# Altium project OBC.PrjPcb (part 2 of 2)

## Sheet Microcontroller_Interfacing.SchDoc
size A4; SheetNumber: 5; SheetTotal: 7
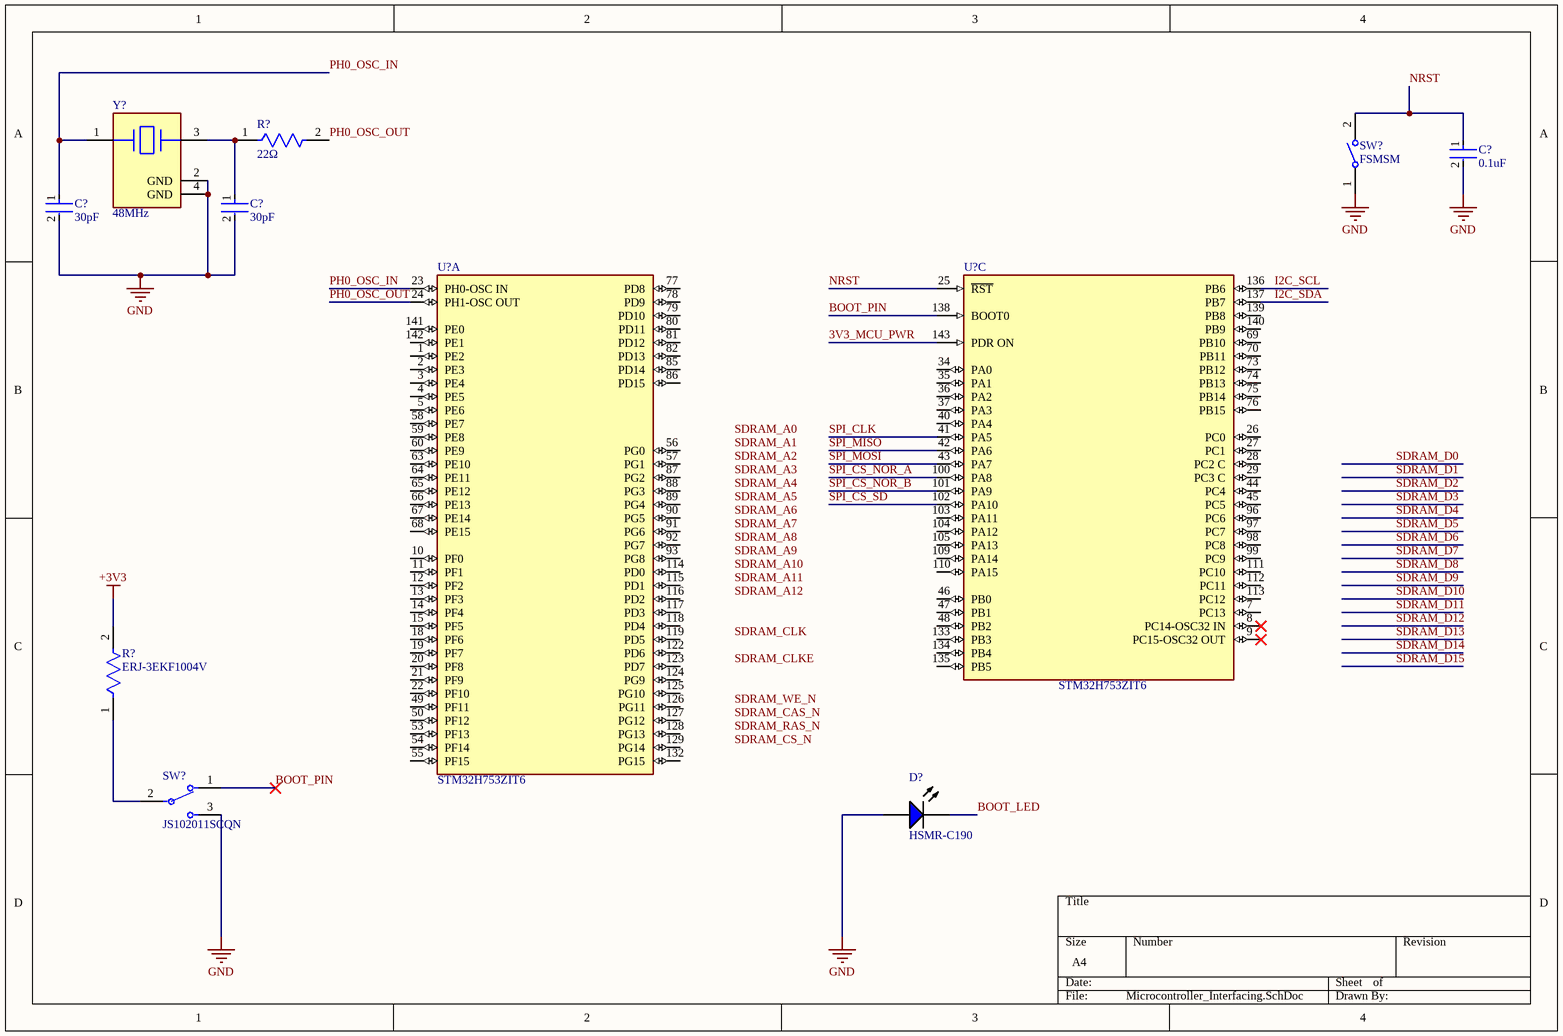
[diagram p5: Microcontroller_Interfacing.SchDoc]

### Parts
(Parts that share a designator on the sheet are numbered #1, #2 ... from top to bottom, then left to right.)
C?#29  0.1uF  [FP-GRM033-0_03-MFG]
C?#30  30pF  [FP-C0603C-CF-MFG]
C?#31  30pF  [FP-C0603C-CF-MFG]
D?#3  HSMR-C190  [AVAG-HSMX-C190_V]
R?#16  22Ω  [FP-CPF0603-MFG]
R?#17  ERJ-3EKF1004V  [FP-ERJ3EK-IPC_C]
SW?#2  FSMSM  [TECO-FSMSM-2_V]
SW?#3  JS102011SCQN  [FP-JS102011SCQN-MFG]
U?#9  STM32H753ZIT6  [FP-LQFP144-1A-MFG]  (part A of 3)
U?#10  STM32H753ZIT6  [FP-LQFP144-1A-MFG]  (part C of 3)
Y?#2  48MHz  [FP-ABM3B-MFG]

### Nets
+3V3: R?#17.2
GND: C?#29.2 C?#30.2 C?#31.2 D?#3.1(A) SW?#2.1 SW?#3.3 Y?#2.2(GND) Y?#2.4(GND)
3V3_MCU_PWR: U?#10.143(PDR_ON)
BOOT_LED: D?#3.2(K)
BOOT_PIN: SW?#3.1 U?#10.138(BOOT0)
I2C_SCL: U?#10.136(PB6)
I2C_SDA: U?#10.137(PB7)
NRST: C?#29.1 SW?#2.2 U?#10.25(~{RST})
PH0_OSC_IN: C?#30.1 U?#9.23(PH0-OSC_IN) Y?#2.1
PH0_OSC_OUT: R?#16.2 U?#9.24(PH1-OSC_OUT)
SPI_CLK: U?#10.41(PA5)
SPI_CS_NOR_A: U?#10.100(PA8)
SPI_CS_NOR_B: U?#10.101(PA9)
SPI_CS_SD: U?#10.102(PA10)
SPI_MISO: U?#10.42(PA6)
SPI_MOSI: U?#10.43(PA7)
NetC?#31_1: C?#31.1 R?#16.1 Y?#2.3
NetR?#17_1: R?#17.1 SW?#3.2(C)

Not connected (* = marked no-connect by the designer): U?#9 1(PE2) 2(PE3) 3(PE4) 4(PE5) 5(PE6) 10(PF0) 11(PF1) 12(PF2) 13(PF3) 14(PF4) 15(PF5) 18(PF6) 19(PF7) 20(PF8) 21(PF9) 22(PF10) 49(PF11) 50(PF12) 53(PF13) 54(PF14) 55(PF15) 56(PG0) 57(PG1) 58(PE7) 59(PE8) 60(PE9) 63(PE10) 64(PE11) 65(PE12) 66(PE13) 67(PE14) 68(PE15) 77(PD8) 78(PD9) 79(PD10) 80(PD11) 81(PD12) 82(PD13) 85(PD14) 86(PD15) 87(PG2) 88(PG3) 89(PG4) 90(PG5) 91(PG6) 92(PG7) 93(PG8) 114(PD0) 115(PD1) 116(PD2) 117(PD3) 118(PD4) 119(PD5) 122(PD6) 123(PD7) 124(PG9) 125(PG10) 126(PG11) 127(PG12) 128(PG13) 129(PG14) 132(PG15) 141(PE0) 142(PE1); U?#10 7(PC13) 8(PC14-OSC32_IN)* 9(PC15-OSC32_OUT)* 26(PC0) 27(PC1) 28(PC2_C) 29(PC3_C) 34(PA0) 35(PA1) 36(PA2) 37(PA3) 40(PA4) 44(PC4) 45(PC5) 46(PB0) 47(PB1) 48(PB2) 69(PB10) 70(PB11) 73(PB12) 74(PB13) 75(PB14) 76(PB15) 96(PC6) 97(PC7) 98(PC8) 99(PC9) 103(PA11) 104(PA12) 105(PA13) 109(PA14) 110(PA15) 111(PC10) 112(PC11) 113(PC12) 133(PB3) 134(PB4) 135(PB5) 139(PB8) 140(PB9)

### Notes on the sheet
- Labels drawn without touching a wire or pin: SDRAM_A0, SDRAM_A1, SDRAM_A2, SDRAM_A3, SDRAM_A4, SDRAM_A5, SDRAM_A6, SDRAM_A7, SDRAM_A8, SDRAM_A9, SDRAM_A10, SDRAM_A11, SDRAM_A12, SDRAM_CAS_N, SDRAM_CLK, SDRAM_CLKE, SDRAM_CS_N, SDRAM_RAS_N, SDRAM_WE_N

### Library data of the parts
C?#29 = CMP-06035-000062-2: Chip Multilayer Ceramic Capacitors for General Purpose, 0201, 0.10uF, X5R, 15%, 10%, 6.3V; Capacitance: 100nF; Min Operating Temperature: -55°C; Lead Free: Lead Free; Radiation Hardening: No; Dielectric: X5R; Voltage Rating (DC): 6.3V; REACH SVHC: No SVHC; Case/Package: 0201; Voltage Rating: 6.3V; Length: 0.6mm; Max Operating Temperature: 85°C; Width: 0.012inch; Depth: 0.3mm; Material: Ceramic; Case Code (Metric): 0603; Thickness: 0.013inch; Packaging: Tape and Reel; Height: 0.3mm; Weight: 6E-06oz; Package Quantity: 1; Mount: Surface Mount; Voltage: 6.3V; Case Code (Imperial): 0201; Tolerance: 10%; Termination: SMD/SMT
C?#30 C?#31 = CMP-1035-00914-3: CAP CER 30PF 50V 5% NP0 0603; Manufacturer Part Number: C0603C300J5GACTU; Manufacturer: KEMET; Automotive Grade: Grade 1; Temperature Coefficient: 30ppm/°C; Material: Ceramic; Temperature Characteristic: C0G; Tolerance: 0.05; Description: C0603 30 pF C0G 30ppm/°C 5.00% 50 V; ComponentLink2URL: https://api.kemet.com/component-edge/download/datasheet/C0603C100J5GACAUTO.pdf; Automotive: Yes; Device Class L2: Capacitors; Device Class L1: Passive Components; Device Class L3: Ceramic Capacitors; RoHS: TRUE; Octopart: https://octopart.com/c0603c300j5gactu-kemet-199455; Lead Free: Yes; Value: 30 pF; Temperature Range High: +125°C; Category: Cap; Temperature: -55°C to +125°C; Package: C0603C-CF; Capacitance: 30 pF; Digikey Description: CAP CER 30PF 50V 5% NP0 0603; Height: 0.87mm; ComponentLink2Description: Datasheet; Temperature Range Low: -55°C; Mouser Description: Multilayer Ceramic Capacitors MLCC - SMD/SMT 50volts 30pF C0G 5%; Voltage Rating: 50 V
D?#3 = CMP-1744-00007-1: LED Uni-Color Blue, 78 mW, 20 mA, -40 to 85 degC, 2-Pin SMD, RoHS, Tape and Reel; Rds On Max: 10 Ohm; Nominal Vgs: -1.7 V; Max Power Dissipation: 360 mW; Elements: 1; Case\Package: TO-236-3; Input Capacitance: 73 pF; Typical Rise Time: 6.3 ns; Nominal Dual Supply Voltage: -50 V; Packaging: Tape and Reel; Height: 0.93 mm; Mount: Surface Mount; RoHSCompliant: true; DatasheetVersion: Apr-10; REACH SVHC: No SVHC; ComponentLink1URL: http://www.avagotech.com/; Radiation Hardening: No; ComponentLink3Description: Package Specification; ComponentLink3URL: http://www.fairchildsemi.com/dwg/MA/MA03D.pdf; ComponentLink2Description: Datasheet; PackageDescription: 2-Pin Surface Mount Device, Body 1.6 x 0.8 mm, Height 0.9 mm; Package Quantity: 3000; PackageReference: HSMX-C190; ComponentLink1Description: Manufacturer URL; Pins: 3; Length: 2.92 mm; ComponentLink2URL: http://docs.avagotech.com/docs/AV02-0977EN; Min Operating Temperature: -55 degC; Width: 1.3 mm; Max Operating Temperature: 150 degC
R?#16 = CMP-03211-007811-1: RES SMD 22Ω 0.1% 1/16W 0603; Manufacturer: TE Connectivity; Manufacturer Part Number: CPF0603B22RE1; Temperature Coefficient: 25ppm/°C; Power Rating: 0.063W; Voltage Rating: 50V; Automotive: No; ComponentLink2Description: Datasheet; Package: CPF0603; Temperature Range High: +155°C; Device Class L1: Passive Components; Resistance: 22Ω; Device Class L3: Chip SMD Resistors; packaging: 1k Reel; Temperature: -55°C to +155°C; Octopart: https://octopart.com/cpf0603b22re1-te+connectivity-9539398; ComponentLink2URL: https://www.te.com/commerce/DocumentDelivery/DDEController?Action=showdoc&DocId=Data+Sheet%7F1773200%7FM%7Fpdf%7FEnglish%7FENG_DS_1773200_M.pdf%7F3-1676481-2; Value: 22Ω; Device Class L2: Resistors; Height: 0.55mm; RoHS: TRUE; Composition: Thin Film; Lead Free: Yes; octopart_url: https://octopart.com/cpf0603b22re1-te+connectivity-9539398; Tolerance: 0.1%; Ipc Land Pattern Name: RESC15580X45; Category: Res; Temperature Range Low: -55°C; Series: CPF
R?#17 = CMP-1012-00849-3: RES SMD 1M OHM 1% 1/10W 0603; Resistance: 1MR; Voltage Rating: 75V; Temperature Coefficient: 100ppm/°C; Power Rating: 100mW; REACH SVHC: No SVHC; Radiation Hardening: No; Features: Automotive AEC-Q200; Case Code (Metric): 1608; Resistance Tolerance: 1%; Case/Package: 0603; Termination: SMD/SMT; Max Operating Temperature: 155°C; Tolerance: 1%; Size Code: 0603; Case Code (Imperial): 0603; Min Operating Temperature: -55°C; Number of Pins: 2; Mount: Surface Mount; Package Quantity: 1; Military Standard: Not; Voltage Rating (DC): 75V; Depth: 0.8mm; Packaging: Tape and Reel; Width: 0.8mm; Number of Terminations: 2; Length: 1.6mm; Height: 0.022inch; RoHS Compliant: Yes; Resistor Type: Thick Film; Contact Plating: Tin; Lead Free: Lead Free; Series: ERJ; Construction: Rectangular; Max Power Dissipation: 100mW
SW?#2 = CMP-2000-07511-1: FSMSM Push Button Switch, 50 mA, -35 to 85 degC, 2-Pin SMD, RoHS, Bulk; Manufacturer: TE Connectivity; Actuator Length: 1.07mm; Electrical Life: 20000Cycles; Actuator Material: Polyamide; Current Rating: 50mA; Illumination Type: Illuminated; Voltage Rating (DC): 24V; Contact Resistance: 100mOhm; Case\/Package: SMD/SMT; Operating Force: 180gf; Switch Travel: 0.25mm; Max Voltage Rating (DC): 12V; Throw Configuration: SPST; Packaging: LoosePiece; Max Operating Temperature: 85degC; ELV: Compliant; Package Description: 2-Pin Surface Mount Device, Body 6 x 3.5 mm, Pitch 9.19 mm; RoHSCompliant: true; Manufacturer URL: http://www.te.com/; Contact Plating: Silver; Contact Material: Brass; Mounting Technology: SurfaceMount; Contact Current Rating: 50mA; Datasheet Version: Rev. C2, 08/2014; Datasheet URL: http://www.te.com/commerce/DocumentDelivery/DDEController?Action=showdoc&DocId=Customer+Drawing%7F1437566-3%7FC2%7Fpdf%7FEnglish%7FENG_CD_1437566-3_C2_1437566_3_1_c.dwg.pdf%7F1437566-3; Mechanical Life: 20000Cycles; Package Reference: FSMSM; REACH SVHC: Unknown; Orientation: Straight; Min Operating Temperature: -35degC; Lead Free: LeadFree; Termination: GullWing; Package Quantity: 1000; Mount: SurfaceMount
SW?#3 = CMP-10038-000023-1: SWITCH SLIDE SPDT 300MA 6V; Electrical Life: 5000Cycles; Actuator Type: Standard; Contact Resistance: 70mR; Actuator Material: Nylon; Max Voltage Rating (DC): 30V; Actuator Length: 2mm; Switch Function: On-On; Actuator Color: Black; Radiation Hardening: No; Throw Configuration: SPDT; Depth: 7.5mm; Case/Package: SMD/SMT; Package Quantity: 4000; Min Operating Temperature: -40°C; Length: 8.5mm; Current Rating: 300mA; Mount: Surface Mount; Voltage Rating (DC): 6V; RoHS Compliant: Yes; Orientation: Straight; Housing Material: Nylon; Contact Plating: Silver; Max Operating Temperature: 85°C; Packaging: Tape and Reel; Switch Travel: 2mm; Max Current Rating: 300mA; Contact Material: Copper Alloy; Series: JS; Termination: Gull Wing
U?#9 U?#10 = CMP-12105-000009-1: LQFP 144 20X20X1.4 2; Manufacturer: STMicroelectronics; Number Of Pwm Channels: 24; Number Of I/Os: 114; Number Of Cores: 1; Min Supply Voltage: 1.62V; Interface: I2C,SPI,UART,USART,CAN,USB,LIN,IrDA,Ethernet,I2S,SMBus,Other; Standoff Height: 0.05mm; Number Of I2C Channels: 4; Max Junction Temp: +125°C; Memory Type: FLASH; Ram Size: 1MBytes; Number Of Spi Channels: 6; Core Architecture: ARM Cortex-M7; Number Of Uart Channels: 9; Memory Size: 2MBytes; Number Of Adc Channels: 36; Frequency: 480MHz; Data Bus Width: 32bits; Max Supply Voltage: 3.6V; Number Of Usb Channels: 2; Number Of A/D Converters: 3; Number Of Timers/Counters: 20; Temperature Range High: +125°C; Automotive: No; Mouser Description: MCU 32-Bit STM32 ARM Cortex M7 RISC 2MB Flash 1.8V/2.5V/3.3V 144-Pin LQFP Tray; Device Class L3: Microcontrollers; Height: 1.6mm; Octopart: https://octopart.com/stm32h753zit6-stmicroelectronics-87879771; Device Class L2: Embedded Processors and Controllers; Lead Free: Yes; Category: IC; ComponentLink2URL: https://www.st.com/resource/en/datasheet/stm32h753zi.pdf; Ambient Temperature Range High: +85°C; Number Of Ethernet Channels: 1; Device Class L1: Integrated Circuits (ICs); Ambient Temperature Range Low: -40°C; Package: LQFP144-1A; Temperature Range Low: -40°C; Digikey Description: LQFP 144 20X20X1.4 2; ComponentLink2Description: Datasheet; Temperature: -40°C to +125°C; Manufacturer Part Number: STM32H753ZIT6; RoHS: TRUE
Y?#2 = CMP-27762-010589-1: Crystal 48MHz ±20ppm 18pF SMD-4 5mm x 3.2mm; Frequency Stability: 50ppm; Series Resistance: 50R; Package Quantity: 1000; Packaging: Tape and Reel; Frequency Tolerance: 20ppm; Depth: 3.2mm; Max Operating Temperature: 70°C; Lead Free: Lead Free; ESR (Equivalent Series Resistance): 50R; Operating Frequency: 48 MHz; REACH SVHC: No SVHC; Frequency: 48MHz; Length: 5mm; Min Operating Temperature: -20°C; Tolerance: 20ppm; Load Capacitance: 18pF; Case/Package: SMD/SMT; Series: ABM3B; Number of Pins: 4; Termination: SMD/SMT; Height: 0.043inch; Resistor Type: Ceramic; Mount: Surface Mount; Width: 3.2mm

## Sheet Mounting_Holes.SchDoc
size A4; SheetNumber: 5; SheetTotal: 6
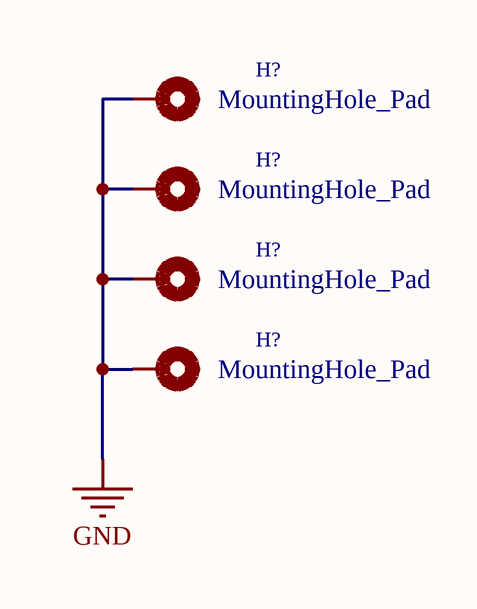
[diagram p6: Mounting_Holes.SchDoc]

### Parts
(Parts that share a designator on the sheet are numbered #1, #2 ... from top to bottom, then left to right.)
H?#1  MountingHole_Pad  [MountingHole_4.3mm_M4_Pad_Via]
H?#2  MountingHole_Pad  [MountingHole_4.3mm_M4_Pad_Via]
H?#3  MountingHole_Pad  [MountingHole_4.3mm_M4_Pad_Via]
H?#4  MountingHole_Pad  [MountingHole_4.3mm_M4_Pad_Via]

### Nets
GND: H?#1.1 H?#2.1 H?#3.1 H?#4.1

### Library data of the parts
H?#1-H?#4 = MountingHole_Pad: Value: MountingHole_Pad; Footprint: MountingHole:MountingHole_4.3mm_M4_Pad_Via

## Sheet Memory.SchDoc
size A4; SheetNumber: 7; SheetTotal: 7
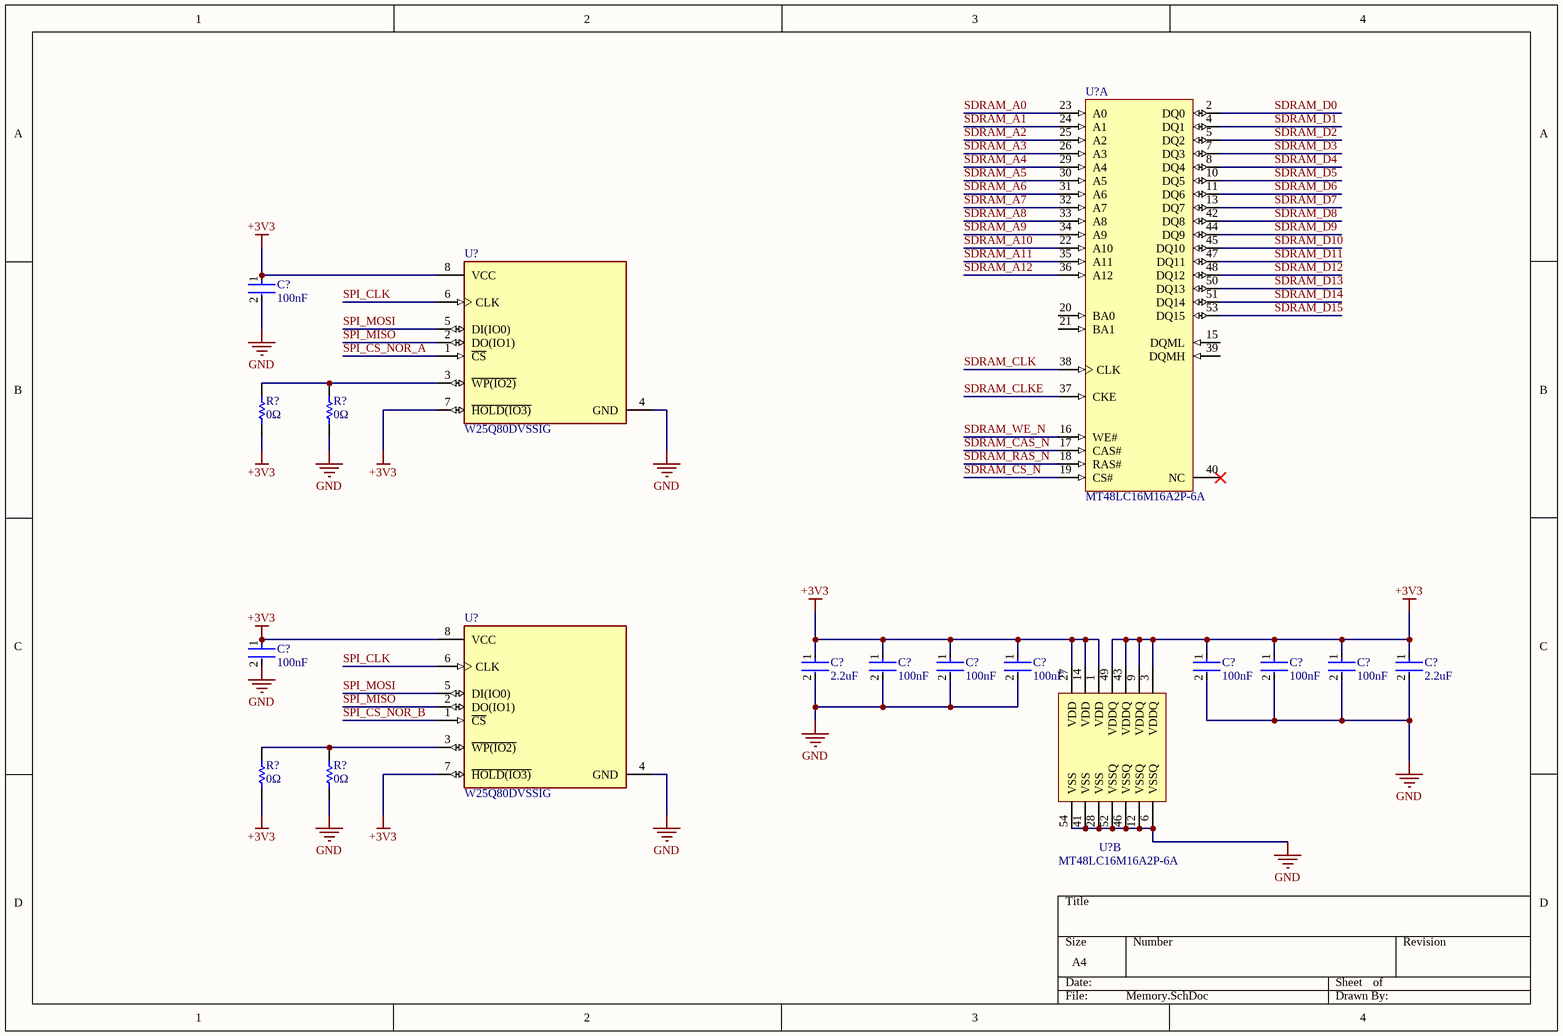
[diagram p7: Memory.SchDoc]

### Parts
(Parts that share a designator on the sheet are numbered #1, #2 ... from top to bottom, then left to right.)
C?#32  100nF  [FP-CGA3E-0_3-0_1-IPC_A]
C?#33  100nF  [FP-CGA3E-0_3-0_1-IPC_A]
C?#34  2.2uF  [FP-GRM188-0_1-e0_2_0_5-MFG]
C?#35  100nF  [FP-CGA3E-0_3-0_1-IPC_A]
C?#36  100nF  [FP-CGA3E-0_3-0_1-IPC_A]
C?#37  100nF  [FP-CGA3E-0_3-0_1-IPC_A]
C?#38  100nF  [FP-CGA3E-0_3-0_1-IPC_A]
C?#39  100nF  [FP-CGA3E-0_3-0_1-IPC_A]
C?#40  100nF  [FP-CGA3E-0_3-0_1-IPC_A]
C?#41  2.2uF  [FP-GRM188-0_1-e0_2_0_5-MFG]
R?#18  0Ω  [RESC1005X40X25LL05T05]
R?#19  0Ω  [RESC1005X40X25LL05T05]
R?#20  0Ω  [RESC1005X40X25LL05T05]
R?#21  0Ω  [RESC1005X40X25LL05T05]
U?#11  MT48LC16M16A2P-6A  [MICT-P-54_N]  (part A of 2)
U?#12  W25Q80DVSSIG  [FP-SS-MFG]
U?#13  W25Q80DVSSIG  [FP-SS-MFG]
U?#14  MT48LC16M16A2P-6A  [MICT-P-54_N]  (part B of 2)

### Nets
+3V3: C?#32.1 C?#33.1 C?#34.1 C?#35.1 C?#36.1 C?#37.1 C?#38.1 C?#39.1 C?#40.1 C?#41.1 R?#18.2 R?#20.2 U?#12.7(~{HOLD(IO3)}) U?#12.8(VCC) U?#13.7(~{HOLD(IO3)}) U?#13.8(VCC) U?#14.1(VDD) U?#14.3(VDDQ) U?#14.9(VDDQ) U?#14.14(VDD) U?#14.27(VDD) U?#14.43(VDDQ) U?#14.49(VDDQ)
GND: C?#32.2 C?#33.2 C?#34.2 C?#35.2 C?#36.2 C?#37.2 C?#38.2 C?#39.2 C?#40.2 C?#41.2 R?#19.2 R?#21.2 U?#12.4(GND) U?#13.4(GND) U?#14.6(VSSQ) U?#14.12(VSSQ) U?#14.28(VSS) U?#14.41(VSS) U?#14.46(VSSQ) U?#14.52(VSSQ) U?#14.54(VSS)
SDRAM_A0: U?#11.23(A0)
SDRAM_A1: U?#11.24(A1)
SDRAM_A2: U?#11.25(A2)
SDRAM_A3: U?#11.26(A3)
SDRAM_A4: U?#11.29(A4)
SDRAM_A5: U?#11.30(A5)
SDRAM_A6: U?#11.31(A6)
SDRAM_A7: U?#11.32(A7)
SDRAM_A8: U?#11.33(A8)
SDRAM_A9: U?#11.34(A9)
SDRAM_A10: U?#11.22(A10)
SDRAM_A11: U?#11.35(A11)
SDRAM_A12: U?#11.36(A12)
SDRAM_CAS_N: U?#11.17(CAS#)
SDRAM_CLK: U?#11.38(CLK)
SDRAM_CLKE: U?#11.37(CKE)
SDRAM_CS_N: U?#11.19(CS#)
SDRAM_D0: U?#11.2(DQ0)
SDRAM_D1: U?#11.4(DQ1)
SDRAM_D2: U?#11.5(DQ2)
SDRAM_D3: U?#11.7(DQ3)
SDRAM_D4: U?#11.8(DQ4)
SDRAM_D5: U?#11.10(DQ5)
SDRAM_D6: U?#11.11(DQ6)
SDRAM_D7: U?#11.13(DQ7)
SDRAM_D8: U?#11.42(DQ8)
SDRAM_D9: U?#11.44(DQ9)
SDRAM_D10: U?#11.45(DQ10)
SDRAM_D11: U?#11.47(DQ11)
SDRAM_D12: U?#11.48(DQ12)
SDRAM_D13: U?#11.50(DQ13)
SDRAM_D14: U?#11.51(DQ14)
SDRAM_D15: U?#11.53(DQ15)
SDRAM_RAS_N: U?#11.18(RAS#)
SDRAM_WE_N: U?#11.16(WE#)
SPI_CLK: U?#12.6(CLK) U?#13.6(CLK)
SPI_CS_NOR_A: U?#12.1(~{CS})
SPI_CS_NOR_B: U?#13.1(~{CS})
SPI_MISO: U?#12.2(DO(IO1)) U?#13.2(DO(IO1))
SPI_MOSI: U?#12.5(DI(IO0)) U?#13.5(DI(IO0))
NetR?#18_1: R?#18.1 R?#19.1 U?#12.3(~{WP(IO2)})
NetR?#20_1: R?#20.1 R?#21.1 U?#13.3(~{WP(IO2)})

Not connected (* = marked no-connect by the designer): U?#11 15(DQML) 20(BA0) 21(BA1) 39(DQMH) 40(NC)*

### Library data of the parts
C?#32 C?#33 C?#35-C?#40 = CMP-2000-07546-2: Cap Ceramic 100nF 50V X7R 10% Pad SMD 0603 +125°C Automotive T/R; Weight: 7.1E-05oz; Composition: Ceramic; Max Operating Temperature: 125°C; Termination: SMD/SMT; Dielectric: X7R; Length: 1.6mm; Package Quantity: 1; REACH SVHC: No SVHC; Lead Free: Lead Free; Case Code (Metric): 1608; Min Operating Temperature: -55°C; Packaging: Tape and Reel; Tolerance: 10%; Voltage Rating: 50V; Case Code (Imperial): 0603; Capacitance: 100nF; Case/Package: 0603; Voltage Rating (DC): 50V; Depth: 0.8mm; Radiation Hardening: No; Ratings: AEC-Q200; Mount: Surface Mount; Voltage: 50V; Thickness: 0.035inch; Width: 0.8mm; Height: 0.8mm
C?#34 C?#41 = CMP-2006-02836-2: Chip Multilayer Ceramic Capacitors for General Purpose, 0603, 2.2uF, X7R, 15%, 10%, 10V; Case Code (Metric): 1608; Height: 0.8mm; Packaging: Cut Tape; Voltage: 10V; Lead Free: Lead Free; Min Operating Temperature: -55°C; Voltage Rating (DC): 10V; Max Operating Temperature: 125°C; Voltage Rating: 10V; Dielectric: X7R; Depth: 0.8mm; Case Code (Imperial): 0603; Termination: SMD/SMT; Case/Package: 0603; Number of Pins: 2; REACH SVHC: No SVHC; Mount: Surface Mount; Width: 0.031inch; Material: Ceramic; Capacitance: 2.2uF; Package Quantity: 1; Weight: 7.1E-05oz; Length: 1.6mm; Thickness: 0.035inch; Tolerance: 10%
R?#18-R?#21 = CMP-2000-07451-1: Chip Resistor, 0 Ohm, 0.1 W, -55 to 155 degC, 0402 (1005 Metric), RoHS, Tape and Reel; Manufacturer: Panasonic; Voltage Rating (DC): 50V; Temperature Coefficient: 600ppm/��C; Max Power Dissipation: 100mW; Resistance: 0mOhm; Tolerance: 5%; Number of Terminations: 2; Mount: SurfaceMount; Height: 0.35mm; Packaging: TapeandReel; Contact Plating: Tin; Manufacturer URL: http://www.panasonic.com/; Composition: ThickFilm; Max Operating Temperature: 155degC; REACH SVHC: NoSVHC; Case/Package: 0402; Package Reference: 402; Depth: 0.5mm; Package Description: 2-Pin Surface Mount Device, Body 1 x 0.5 mm; Datasheet URL: https://industrial.panasonic.com/cdbs/www-data/pdf/RDA0000/AOA0000C301.pdf; RoHSCompliant: True; Case Code (Imperial): 0402; Military Standard: Not; Min Operating Temperature: -55degC; Power Rating: 100mW; Datasheet Version: 03/2015; Length: 1mm; Case Code (Metric): 1005; Termination: SMD/SMT; Mounting Technology: SurfaceMount; Voltage Rating: 50V; Width: 0.02inch; Package Quantity: 1; Lead Free: LeadFree; Radiation Hardening: No
U?#11 U?#14 = CMP-0351-00100-1: 256Mb PC133 SDR SDRAM, 16Mb x 16, 6ns, 3.3V, 0 to 70 degC, 54-Pin TSOP, Pb-Free; Manufacturer: Micron; CL: CL = 3Â; Density: 256MbÂ; Op. Temp.: 0C to +70CÂ; Clock Rate: 167 MHzÂ; Cycle Time: 6nsÂ; Data Rate: PC133Â; Voltage: 3.3VÂ; ComponentLink1URL: http://www.micron.com/; Mounting Technology: Surface Mount; ComponentLink3Description: Package Specification; Depth: 16MbÂ; ComponentLink3URL: http://www.micron.com/~/media/Documents/Products/Data%20Sheet/DRAM/128mb_x4x8x16_sdram.pdf; DatasheetVersion: Rev.Q; PartNumber: MT48LC16M16A2P-6A; PackageVersion: Rev.Q; ComponentLink2URL: http://www.micron.com/~/media/Documents/Products/Data%20Sheet/DRAM/256Mb_sdr.pdf; PackageReference: MICT-P-54; ComponentLink2Description: Datasheet; Width: x16Â; ComponentLink1Description: Manufacturer URL; PackageDescription: 54-Pin Thin Small Outline Package, 10.16 x 22.22 mm, Pitch 0.8 mm; RoHS: YesÂ
U?#12 U?#13 = CMP-2000-07408-2: IC FLASH 8MBIT SPI 104MHZ 8SOIC; Memory Type: Non-Volatile; Memory Size: 8Mb; Frequency: 104MHz; Min Operating Temperature: -40°C; Mount: Surface Mount; RoHS Compliant: Yes; Packaging: Rail/Tube; Case/Package: SOIC; Max Operating Temperature: 85°C; Series: SpiFlash®; Interface: SPI

## Nets that join several sheets
+3V3: Connectors (J?#3.D25 L?.2), Power (10 pins), Telemetry (8 pins), Microcontroller_Interfacing (R?#17.2), Memory (23 pins)
+5V0: Connectors (J?#2.A9 J?#2.B9 J?#3.D26), Power (C?#5.1 D?#1.1 U1#3.1), Telemetry (?.8 C?#6.1)
GND: Connectors (15 pins), Sheet1 (10 pins), Power (12 pins), Telemetry (13 pins), Microcontroller_Power (30 pins), Microcontroller_Interfacing (8 pins), Mounting_Holes (H?#1.1 H?#2.1 H?#3.1 H?#4.1), Memory (21 pins)
3V3_MCU_PWR: Power (U?#5.4), Microcontroller_Power (29 pins), Microcontroller_Interfacing (U?#10.143)
COMMS_Reset: Connectors (J?#3.D30), Power (U2#3.6)
COMMS_Set: Connectors (J?#3.D29), Power (U2#3.7)
EPS_Reset: Connectors (J?#3.D28), Power (U2#3.12)
EPS_Set: Connectors (J?#3.D27), Power (U2#3.11)
I2C_SCL: Connectors (J?#3.B30), Telemetry (?.6 R?#14.2 U?#6.2 U?#7.10), Microcontroller_Interfacing (U?#10.136)
I2C_SDA: Connectors (J?#3.B29), Telemetry (?.5 R?#15.2 U?#6.1 U?#7.9), Microcontroller_Interfacing (U?#10.137)
SPI_CLK: Connectors (J?#1.5 J?#3.B28), Microcontroller_Interfacing (U?#10.41), Memory (U?#12.6 U?#13.6)
SPI_CS_NOR_A: Microcontroller_Interfacing (U?#10.100), Memory (U?#12.1)
SPI_CS_NOR_B: Microcontroller_Interfacing (U?#10.101), Memory (U?#13.1)
SPI_CS_SD: Connectors (J?#1.2), Microcontroller_Interfacing (U?#10.102)
SPI_MISO: Connectors (J?#1.7 J?#3.B26), Microcontroller_Interfacing (U?#10.42), Memory (U?#12.2 U?#13.2)
SPI_MOSI: Connectors (J?#1.3 J?#3.B27), Microcontroller_Interfacing (U?#10.43), Memory (U?#12.5 U?#13.5)